# EAGLE design 4x4 (EAGLE 8.4.3)
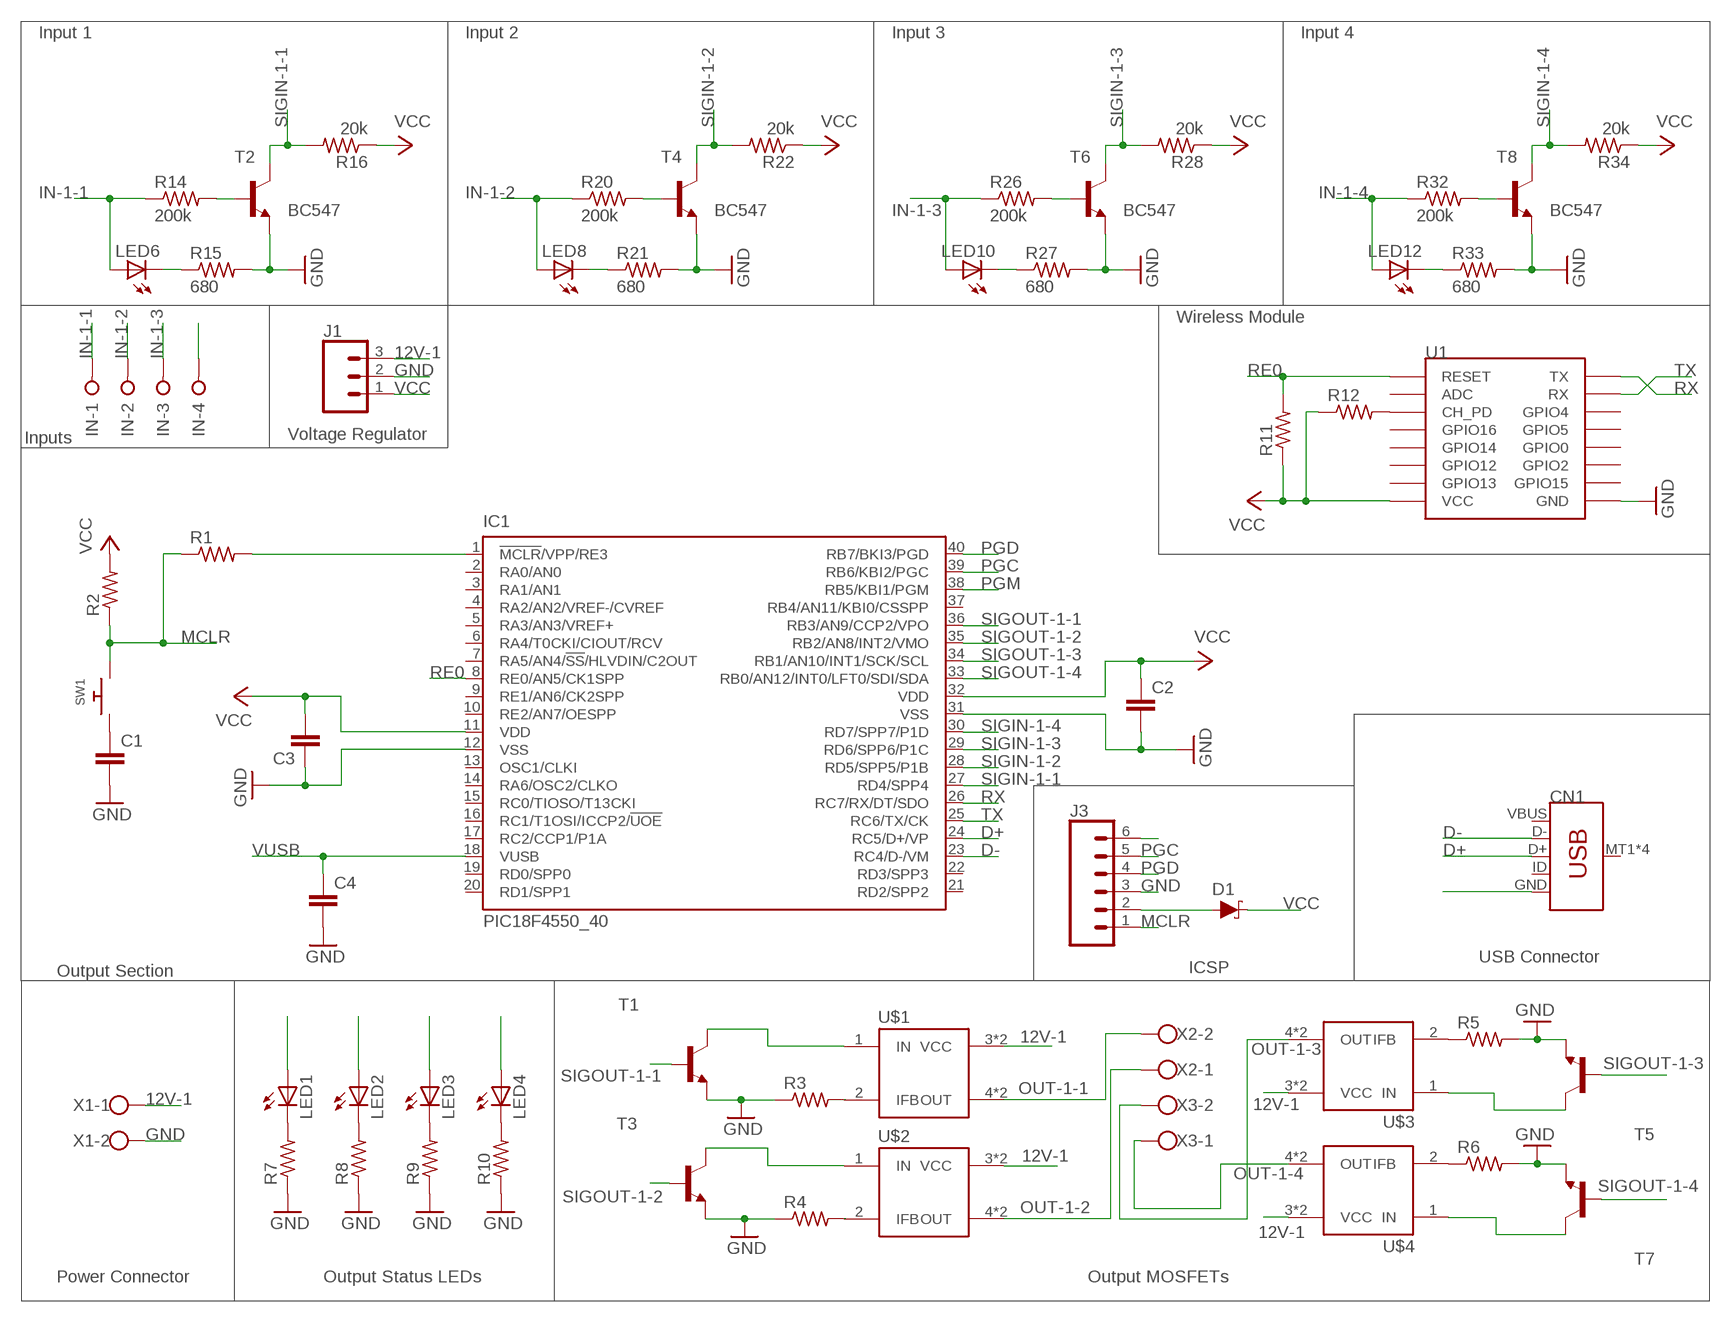
[diagram p0: schematic, sheet 1]

## Parts
C1  C-EUC0805  [C0805]
C2  C-EUC0805  [C0805]
C3  C-EUC0805  [C0805]
C4  C-EUC0805  [C0805]
CN1  USB_MICRO-B_SMT  [USB-MICROB]
D1  DIODE-SCHOTTKY-BAT20J  [SOD-323]
IC1  PIC18F4550_40  [DIL40]
IN  W237-04P  [W237-4P]
J1  CONN_03LONGPADS  [1X03_LONGPADS]
J3  CONN_06LONGPADS  [1X06_LONGPADS]
LED1  LEDCHIP-LED0805  [CHIP-LED0805]
LED2  LEDCHIP-LED0805  [CHIP-LED0805]
LED3  LEDCHIP-LED0805  [CHIP-LED0805]
LED4  LEDCHIP-LED0805  [CHIP-LED0805]
LED6  LEDCHIP-LED0805  [CHIP-LED0805]
LED8  LEDCHIP-LED0805  [CHIP-LED0805]
LED10  LEDCHIP-LED0805  [CHIP-LED0805]
LED12  LEDCHIP-LED0805  [CHIP-LED0805]
R1  R-US_R0805  [R0805]
R2  R-US_R0805  [R0805]
R3  R-US_R0805  [R0805]
R4  R-US_R0805  [R0805]
R5  R-US_R0805  [R0805]
R6  R-US_R0805  [R0805]
R7  R-US_R0805  [R0805]
R8  R-US_R0805  [R0805]
R9  R-US_R0805  [R0805]
R10  R-US_R0805  [R0805]
R11  R-US_R0805  [R0805]
R12  R-US_R0805  [R0805]
R14  200k  R-US_R0805  [R0805]
R15  680  R-US_R0805  [R0805]
R16  20k  R-US_R0805  [R0805]
R20  200k  R-US_R0805  [R0805]
R21  680  R-US_R0805  [R0805]
R22  20k  R-US_R0805  [R0805]
R26  200k  R-US_R0805  [R0805]
R27  680  R-US_R0805  [R0805]
R28  20k  R-US_R0805  [R0805]
R32  200k  R-US_R0805  [R0805]
R33  680  R-US_R0805  [R0805]
R34  20k  R-US_R0805  [R0805]
SW1  SWITCH_PUSHBUTTONSOFTTOUCHSMD_SJ  [PUSHBUTTON_SMD_SJ]
T1  -NPN-SOT23-EBC  [SOT23-EBC]
T2  BC547  BC847ALT1-NPN-SOT23-BEC  [SOT23-BEC]
T3  -NPN-SOT23-EBC  [SOT23-EBC]
T4  BC547  BC847ALT1-NPN-SOT23-BEC  [SOT23-BEC]
T5  -NPN-SOT23-EBC  [SOT23-EBC]
T6  BC547  BC847ALT1-NPN-SOT23-BEC  [SOT23-BEC]
T7  -NPN-SOT23-EBC  [SOT23-EBC]
T8  BC547  BC847ALT1-NPN-SOT23-BEC  [SOT23-BEC]
U1  ESP12SMD  [ESP12-SMD]
U$1  IR3315  [TO-220-5]
U$2  IR3315  [TO-220-5]
U$3  IR3315  [TO-220-5]
U$4  IR3315  [TO-220-5]
X1  W237-102  [W237-102]
X2  W237-102  [W237-102]
X3  W237-102  [W237-102]

## Nets
12V-1: J1.3 U$1.3(VCC) U$1.TAB(VCC) U$2.3(VCC) U$2.TAB(VCC) U$3.3(VCC) U$3.TAB(VCC) U$4.3(VCC) U$4.TAB(VCC) X1.1
D+: CN1.D+ IC1.24(RC5/D+/VP)
D-: CN1.D- IC1.23(RC4/D-/VM)
GND: C1.2 C2.2 C3.1 C4.2 CN1.GND IC1.12(VSS) IC1.31(VSS) J1.2 J3.3 R3.1 R4.1 R5.2 R6.2 R7.1 R8.1 R9.1 R10.1 R15.2 R21.2 R27.2 R33.2 T1.E T2.E T3.E T4.E T5.E T6.E T7.E T8.E U1.GND X1.2
IN-1-1: IN.1 LED6.A R14.1
IN-1-2: IN.2 LED8.A R20.1
IN-1-3: IN.3 LED10.A R26.1
IN-1-4: IN.4 LED12.A R32.1
MCLR: J3.1 R1.1 R2.1 SW1.P$1
N$1: C1.1 SW1.P$2
N$2: R3.2 U$1.2(IFB)
N$3: IC1.1(!MCLR!/VPP/RE3) R1.2
N$4: R5.1 U$3.2(IFB)
N$5: R6.1 U$4.2(IFB)
N$6: LED1.C R7.2
N$7: LED2.C R8.2
N$8: LED3.C R9.2
N$9: LED4.C R10.2
N$10: J3.6
N$11: R12.2 U1.CH_PD
N$12: R14.2 T2.B
N$13: LED6.C R15.1
N$14: R4.2 U$2.2(IFB)
N$16: R20.2 T4.B
N$17: LED8.C R21.1
N$19: D1.A J3.2
N$20: R26.2 T6.B
N$21: LED10.C R27.1
N$24: R32.2 T8.B
N$25: LED12.C R33.1
OUT2: T3.C U$2.1(IN)
OUT3: T5.C U$3.1(IN)
OUT4: T7.C U$4.1(IN)
OUT-1-1: LED1.A U$1.4(OUT) U$1.5(OUT) X2.2
OUT-1-2: LED2.A U$2.4(OUT) U$2.5(OUT) X2.1
OUT-1-3: LED3.A U$3.4(OUT) U$3.5(OUT) X3.2
OUT-1-4: LED4.A U$4.4(OUT) U$4.5(OUT) X3.1
PGC: IC1.39(RB6/KBI2/PGC) J3.5
PGD: IC1.40(RB7/BKI3/PGD) J3.4
PGM: IC1.38(RB5/KBI1/PGM)
RE0: IC1.8(RE0/AN5/CK1SPP) R11.2 U1.RESET
RX: IC1.26(RC7/RX/DT/SDO) U1.TXD0(TX)
SIG1: T1.C U$1.1(IN)
SIGIN-1-1: IC1.27(RD4/SPP4) R16.2 T2.C
SIGIN-1-2: IC1.28(RD5/SPP5/P1B) R22.2 T4.C
SIGIN-1-3: IC1.29(RD6/SPP6/P1C) R28.2 T6.C
SIGIN-1-4: IC1.30(RD7/SPP7/P1D) R34.2 T8.C
SIGOUT-1-1: IC1.36(RB3/AN9/CCP2/VPO) T1.B
SIGOUT-1-2: IC1.35(RB2/AN8/INT2/VMO) T3.B
SIGOUT-1-3: IC1.34(RB1/AN10/INT1/SCK/SCL) T5.B
SIGOUT-1-4: IC1.33(RB0/AN12/INT0/LFT0/SDI/SDA) T7.B
TX: IC1.25(RC6/TX/CK) U1.RXD0(RX)
VCC: C2.1 C3.2 D1.C IC1.11(VDD) IC1.32(VDD) J1.1 R2.2 R11.1 R12.1 R16.1 R22.1 R28.1 R34.1 U1.VCC
VUSB: C4.1 IC1.18(VUSB)
Unconnected: CN1.ID CN1.MT1(SHIELD) CN1.MT2(SHIELD) CN1.P$1(SHIELD) CN1.P$2(SHIELD) IC1.2(RA0/AN0) IC1.3(RA1/AN1) IC1.4(RA2/AN2/VREF-/CVREF) IC1.5(RA3/AN3/VREF+) IC1.6(RA4/T0CKI/CIOUT/RCV) IC1.7(RA5/AN4/!SS!/HLVDIN/C2OUT) IC1.9(RE1/AN6/CK2SPP) IC1.10(RE2/AN7/OESPP) IC1.13(OSC1/CLKI) IC1.14(RA6/OSC2/CLKO) IC1.15(RC0/TIOSO/T13CKI) IC1.16(RC1/T1OSI/ICCP2/!UOE) IC1.17(RC2/CCP1/P1A) IC1.19(RD0/SPP0) IC1.20(RD1/SPP1) IC1.21(RD2/SPP2) IC1.22(RD3/SPP3) IC1.37(RB4/AN11/KBI0/CSSPP) U1.ADC U1.GPIO0 U1.GPIO2 U1.GPIO4 U1.GPIO5 U1.GPIO12 U1.GPIO13 U1.GPIO14 U1.GPIO15 U1.GPIO16

## Notes on the sheet
- Input 1 | Input 2 | Input 3 | Input 4
- Wireless Module
- Inputs | Voltage Regulator
- USB Connector
- Output Section | ICSP
- Power Connector | Output Status LEDs | Output MOSFETs

## Power pins joined to a net without a drawn wire
VBUS: CN1.VBUS

## Library data of the parts
C1-C4 = resistor:C-EU: CAPACITOR, European symbol
CN1 = SparkFun-Connectors:USB_MICRO-B: USB Type Micro-B Connector Male/female and PTH/SMT variants SparkFun Products: SparkFun microB USB Breakout <https://www.sparkfun.com/products/12035> SparkFun USB microB Plug Breakout <https://www.sparkfun.com/products/10031> SparkFun ESP8266 Thing <https://www.sparkfun.com/products/13231>; PROD_ID: CONN-09505; SF_ID: PRT-08533
D1 = SparkFun-DiscreteSemi:DIODE-SCHOTTKY: Schottky diode A Schottky diode is a semiconductor diode which has a low forward voltage drop and a very fast switching action.; PROD_ID: DIO-11623; VALUE: 1A/23V/620mV
IC1 = microchip:PIC18F4*_40: USB Microcontrollers with nanoWatt Technology High-Performance, Enhanced Flash, 28/40/44-Pin, Source: http://ww1.microchip.com/downloads/en/devicedoc/39632c.pdf; MF: MICROCHIP; MPN: PIC18F4550-I/P; OC_FARNELL: 9321357; OC_NEWARK: 74K8623
IN = con-wago-508:W237-04P: WAGO SREW CLAMP; OC_FARNELL: unknown; OC_NEWARK: unknown
J1 = SparkFun-Connectors:CONN_03: Multi connection point. Often used as Generic Header-pin footprint for 0.1 inch spaced/style header connections On any of the 0.1 inch spaced packages, you can populate with these: Break Away Headers - Straight <https://www.sparkfun.com/products/116> (PRT-00116) Break Away Male Headers - Right Angle <https://www.sparkfun.com/products/553> (PRT-00553) Female Headers <https://www.sparkfun.com/products/115> (PRT-00115) Break Away Headers - Machine Pin <https://www.sparkfun.com/products/117> (PRT-00117) Break Away Female Headers - Swiss Machine Pin <https://www.sparkfun.com/products/743> (PRT-00743) Stackable Header - 3 Pin (Female, 0.1") <https://www.sparkfun.com/products/13875> (PRT-13875) For SCREWTERMINALS and SPRING TERMINALS visit here: Screw Terimnals on SparkFun.com <https://www.sparkfun.com/search/results?term=Screw+Terminals> (5mm/3.5mm/2.54mm spacing) This device is also useful as a general connection point to wire up your design to another part of your project. Our various solder wires solder well into these plated through hole pads. Hook-Up Wire - Assortment (Stranded, 22 AWG) <https://www.sparkfun.com/products/11375> (PRT-11375) Hook-Up Wire - Assortment (Solid Core, 22 AWG) <https://www.sparkfun.com/products/11367> (PRT-11367) View the entire wire category on our website here <https://www.sparkfun.com/categories/141> Special notes: Molex polarized connector foot print use with SKU : PRT-08232 with associated crimp pins and housings.
J3 = SparkFun-Connectors:CONN_06: Multi connection point. Often used as Generic Header-pin footprint for 0.1 inch spaced/style header connections On any of the 0.1 inch spaced packages, you can populate with these: Break Away Headers - Straight <https://www.sparkfun.com/products/116> (PRT-00116) Break Away Male Headers - Right Angle <https://www.sparkfun.com/products/553> (PRT-00553) Female Headers <https://www.sparkfun.com/products/115> (PRT-00115) Break Away Headers - Machine Pin <https://www.sparkfun.com/products/117> (PRT-00117) Break Away Female Headers - Swiss Machine Pin <https://www.sparkfun.com/products/743> (PRT-00743) Arduino Stackable Header - 6 Pin <https://www.sparkfun.com/products/9280> (PRT-09280) For SCREWTERMINALS and SPRING TERMINALS visit here: Screw Terimnals on SparkFun.com <https://www.sparkfun.com/search/results?term=Screw+Terminals> (5mm/3.5mm/2.54mm spacing) This device is also useful as a general connection point to wire up your design to another part of your project. Our various solder wires solder well into these plated through hole pads. Hook-Up Wire - Assortment (Stranded, 22 AWG) <https://www.sparkfun.com/products/11375> (PRT-11375) Hook-Up Wire - Assortment (Solid Core, 22 AWG) <https://www.sparkfun.com/products/11367> (PRT-11367) View the entire wire category on our website here <https://www.sparkfun.com/categories/141>
LED1-LED4 = adafruit:LED: LED
LED6 LED8 LED10 LED12 = led:LED: LED
R1-R12 R14-R16 R20-R22 R26-R28 R32-R34 = resistor:R-US_: RESISTOR, American symbol
SW1 = adafruit:SWITCH_PUSHBUTTON: Buttons SOFTTOUCHSMD_SJ - Soft touch temporary push button (Super Junk Akihabara) Compatible with SKPMANE010 [Mouser: 688-SKPMAN] C&K_KSS = Digikey: KSS221GLFS
T1-T8 = transistor:*-NPN-: NPN Transistror BF959 corrected 2008.03.06
U1 = esp8266modules:ESP12: ESP8266 Wifi module 12
U$1-U$4 = jgennari:IR3315
X1-X3 = con-wago-500:W237-102: WAGO SCREW CLAMP; MPN: 237-102; OC_FARNELL: unknown; OC_NEWARK: 70K9898

## Board
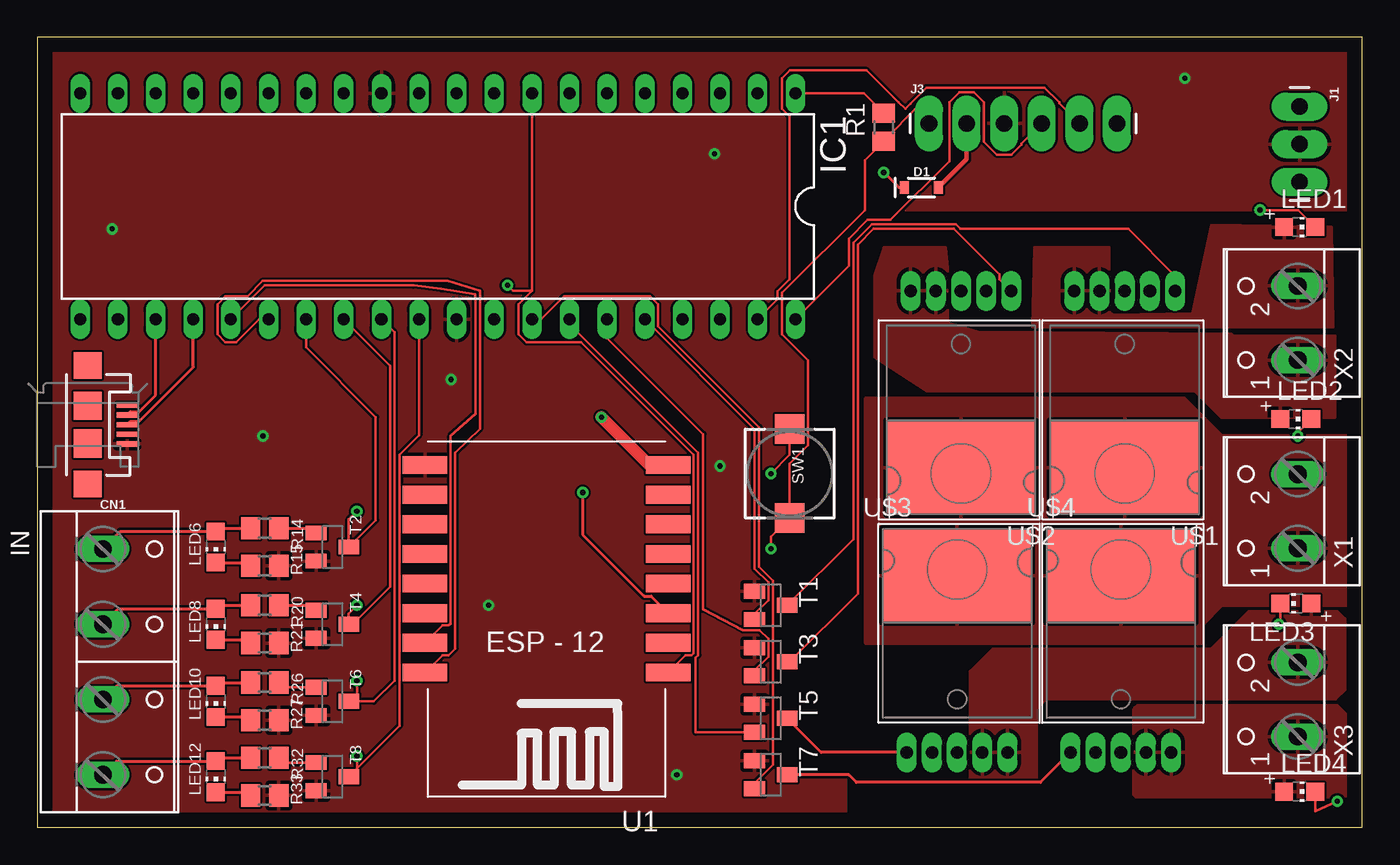
[diagram p1: board, top side]
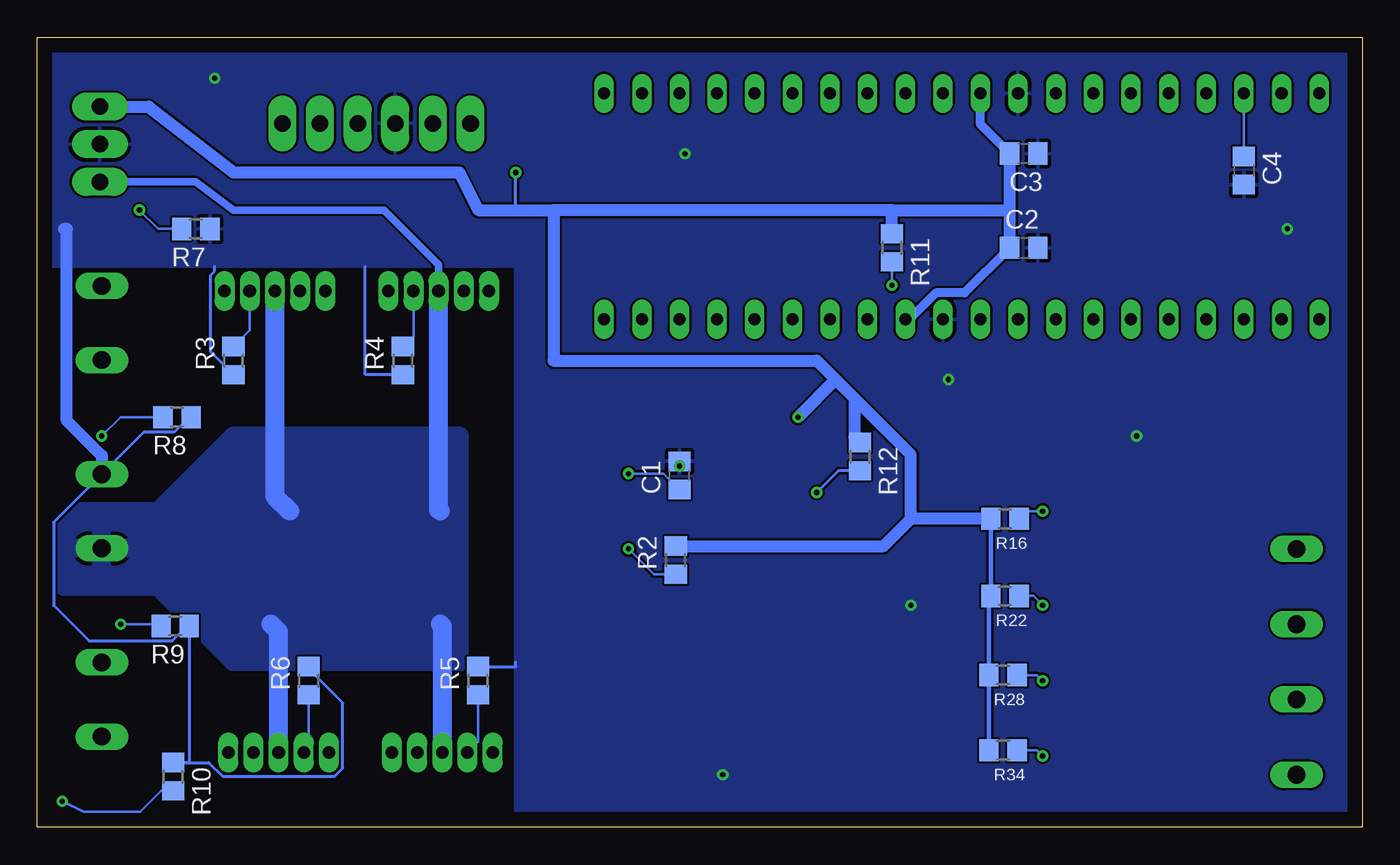
[diagram p2: board, bottom side, seen from below]

Size 89.46 x 53.33 mm. Coordinates in mm from the lower left corner, seen from the top.
Outline: 0,0 89.46,0 89.46,53.33 0,53.33 0,0
Copper layers (1*16): Top 0.035mm / dielectric 1.5mm / Bottom 0.035mm
Design rules "default": minimum track width 6mil, minimum drill 0.35mm, track to track 6mil, track to pad 6mil, pad to pad 6mil, via to via 6mil, smd to smd 6mil, copper to edge 40mil, drill to drill 6mil, minimum pad ring 10mil, minimum via ring 8mil, stop-mask expansion 4mil, vias tented up to drill 0mil, thermal gap 10mil

### Footprints (pad centres in the part's own frame; a part is rotated, then mirrored left to right if it is on the bottom)
C0805 = smd 1.3 x 1.5: 1 -0.95,0; 2 0.95,0
USB-MICROB = smd 1.4 x 0.35: D+ -2.65,0; D- -2.65,-0.65; GND -2.65,1.3; ID -2.65,0.65; VBUS -2.65,-1.3 | smd 1.9 x 1.8: MT1 0,-4; MT2 0,4 | smd 1.9 x 1.9: P$1 0,-1.27; P$2 0,1.27
SOD-323 = smd 0.63 x 0.83: A 1.15,0; C -1.15,0
DIL40 = drill 0.813 long: 1 -24.13,-7.62; 2 -21.59,-7.62; 3 -19.05,-7.62; 4 -16.51,-7.62; 5 -13.97,-7.62; 6 -11.43,-7.62; 7 -8.89,-7.62; 8 -6.35,-7.62; 9 -3.81,-7.62; 10 -1.27,-7.62; 11 1.27,-7.62; 12 3.81,-7.62; 13 6.35,-7.62; 14 8.89,-7.62; 15 11.43,-7.62; 16 13.97,-7.62; 17 16.51,-7.62; 18 19.05,-7.62; 19 21.59,-7.62; 20 24.13,-7.62; 21 24.13,7.62; 22 21.59,7.62; 23 19.05,7.62; 24 16.51,7.62; 25 13.97,7.62; 26 11.43,7.62; 27 8.89,7.62; 28 6.35,7.62; 29 3.81,7.62; 30 1.27,7.62; 31 -1.27,7.62; 32 -3.81,7.62; 33 -6.35,7.62; 34 -8.89,7.62; 35 -11.43,7.62; 36 -13.97,7.62; 37 -16.51,7.62; 38 -19.05,7.62; 39 -21.59,7.62; 40 -24.13,7.62
W237-4P = drill 1.194 long: 1 -7.62,-0.635; 2 -2.54,-0.635; 3 2.54,-0.635; 4 7.62,-0.635
1X03_LONGPADS = drill 1.118 pad 1.88 long: 1 0,0; 2 2.54,0; 3 5.08,0
1X06_LONGPADS = drill 1.118 pad 1.88 long: 1 0,0; 2 2.54,0; 3 5.08,0; 4 7.62,0; 5 10.16,0; 6 12.7,0
CHIP-LED0805 = smd 1.2 x 1.2: A 0,-1.05; C 0,1.05
R0805 = smd 1.3 x 1.5: 1 -0.95,0; 2 0.95,0
PUSHBUTTON_SMD_SJ = smd 2 x 2: P$1 3,0; P$2 -3,0
SOT23-EBC = smd 1 x 1.4: B 0.95,-1.1; C 0,1.1; E -0.95,-1.1
SOT23-BEC = smd 1 x 1.4: B -0.95,-1.1; C 0,1.1; E 0.95,-1.1
ESP12-SMD = smd 3 x 1.2: ADC -8.3,3.8; CH_PD -8.3,1.8; GND 8.1,-8.2; GPIO0 8.1,-2.2; GPIO2 8.1,-4.2; GPIO4 8.1,1.8; GPIO5 8.1,-0.2; GPIO12 -8.3,-4.2; GPIO13 -8.3,-6.2; GPIO14 -8.3,-2.2; GPIO15 8.1,-6.2; GPIO16 -8.3,-0.2; RESET -8.3,5.8; RXD0 8.1,3.8; TXD0 8.1,5.8; VCC -8.3,-8.2
TO-220-5 = drill 0.85 long: 1 -3.4,-12.33; 2 -1.7,-12.33; 3 0,-12.33; 4 1.7,-12.33; 5 3.4,-12.33 | smd 10 x 6.3: TAB 0,-0.4
W237-102 = drill 1.194 long: 1 -2.5,-1.27; 2 2.5,-1.27

### Placement (x,y rotation side)
C1  46.1,23.75 90 bottom
C2  22.86,39.12 0 bottom
C3  22.86,45.47 180 bottom
C4  8,44.32 270 bottom
CN1  3.43,27.18 180 top
D1  59.69,43.18 0 top
IC1  27.05,41.91 180 top
IN  5.08,11.18 270 top
J1  85.22,48.64 270 top
J3  60.2,47.5 0 top
LED1  85.22,40.51 270 top
LED2  84.96,27.56 270 top
LED3  84.96,15.11 90 top
LED4  85.22,2.41 270 top
LED6  12.06,18.92 180 top
LED8  12.06,13.72 180 top
LED10  12.06,8.51 180 top
LED12  12.06,3.43 180 top
R1  57.15,47.24 90 top
R2  46.35,18.03 90 bottom
R3  76.2,31.5 90 bottom
R4  64.77,31.5 90 bottom
R5  59.69,9.91 90 bottom
R6  71.12,9.91 90 bottom
R7  78.74,40.39 180 bottom
R8  80.01,27.69 180 bottom
R9  80.14,13.59 180 bottom
R10  80.26,3.43 270 bottom
R11  31.75,39.12 270 bottom
R12  33.91,25.02 270 bottom
R14  15.37,20.19 0 top
R15  15.37,17.65 0 top
R16  24.13,20.83 0 bottom
R20  15.37,14.99 0 top
R21  15.37,12.45 0 top
R22  24.13,15.62 0 bottom
R26  15.37,9.78 0 top
R27  15.37,7.24 0 top
R28  24.26,10.29 0 bottom
R32  15.37,4.7 0 top
R33  15.37,2.16 0 top
R34  24.26,5.21 0 bottom
SW1  50.8,23.88 270 top
T1  49.53,14.99 270 top
T2  19.94,18.92 270 top
T3  49.53,11.18 270 top
T4  19.94,13.72 270 top
T5  49.53,7.37 270 top
T6  19.94,8.51 270 top
T7  49.53,3.56 270 top
T8  19.94,3.43 270 top
U1  34.29,16.26 180 top
U$1  73.41,23.88 180 top
U$2  62.36,23.88 180 top
U$3  62.1,17.4 0 top
U$4  73.15,17.4 0 top
X1  83.82,21.34 90 top
X2  83.82,34.04 90 top
X3  83.82,8.64 90 top

### Tracks (layer width: path | path; a pad name or v marks a point on that pad's centre or on a via)
12V-1
  Bottom 0.508: 62.36,37.72 U$2.3 62.36,37.97 66.04,41.66 76.2,41.66 78.74,43.56 J1.3
  Bottom 1.27: U$3.3 62.1,13.59 62.23,13.72 | U$4.3 73.15,13.21 73.66,13.72 | U$1.3 73.41,22.35 72.39,21.34 | U$2.3 62.36,21.46 62.23,21.34
  pour Top: 55.88,27.69 55.88,12.45 78.74,12.45 78.74,13.72 80.01,14.99 88.9,14.99 88.9,26.42 81.28,26.42 80.01,26.42 77.47,28.96 55.88,28.96
  pour Bottom: 81.28,16.26 87.63,16.26 88.9,17.53 88.9,20.07 87.63,21.34 81.28,21.34 76.2,26.42 60.96,26.42 60.96,11.18 76.2,11.18
D+
  Top 0.203: CN1.D+ 6.3,27.4 6.88,27.4 10.54,31.06 IC1.24
D-
  Top 0.203: CN1.D- 6.3,28.05 6.88,28.05 8,29.17 IC1.23
GND  (via drill 0.35)
  Bottom 0.203: R8.1 79.2,27.69 80.21,26.68 82.24,26.68 X1.2 88.34,20.58 88.34,14.99 85.94,12.59 80.33,12.59 79.33,13.59 R9.1 79.19,4.38 R10.1 77.86,4.38 76.94,3.46 69.37,3.46 68.82,4 68.82,8.41 71.12,10.71 R6.2 | R4.1 67.31,30.55 67.31,37.85 | 77.47,37.85 77.47,37.54 77.74,37.27 77.74,32.09 R3.1 | R5.2 57.15,10.86 57.15,11.18
  Bottom 0.813: X1.2 85.09,25.09 87.44,27.44 87.44,40.39 87.63,40.39
  other vias: 27.94,30.23 46.1,24.38 5.08,40.39 45.72,45.47 77.47,50.55 43.18,3.56 30.48,14.99 15.24,26.42
  pour Bottom: -2.54,55.63 -2.54,-4.06 57.15,-4.06 57.15,37.85 58.42,37.85 91.44,37.85 91.44,50.55 91.44,55.63
  pour Top: -2.54,55.63 -2.54,-1.52 54.61,-1.52 54.61,41.66 59.69,41.66 90.17,41.66 90.17,53.09 90.17,55.63
IN-1-1
  Top 0.203: IN.1 5.62,19.97 LED6.A 12.29,20.19 R14.1
IN-1-2
  Top 0.203: IN.2 5.5,14.77 LED8.A 12.29,14.99 R20.1
IN-1-3
  Top 0.203: IN.3 5.37,9.56 LED10.A 12.29,9.78 R26.1
IN-1-4
  Top 0.203: IN.4 5.37,4.48 LED12.A 12.29,4.7 R32.1
MCLR  (via drill 0.35)
  Top 0.152: v49.53,18.8 49.53,19.61 SW1.P$1 50.8,24.55 52.03,25.78 52.03,31.52 50.29,33.26 50.29,36.07 55.88,41.66 55.88,45.03 57.37,46.52 | J3.1 59.25,48.45 57.37,46.52 | 57.37,46.52 R1.1
  Bottom 0.152: v49.53,18.8 47.82,17.08 R2.1
N$1  (via drill 0.35)
  Top 0.152: v49.53,23.88 50.8,25.15 SW1.P$2
  Bottom 0.152: C1.1 47.18,23.88 v49.53,23.88
N$2
  Bottom 0.152: U$1.2 75.11,33.54 R3.2
N$3
  Top 0.152: IC1.1 55.81,49.53 R1.2
N$4
  Bottom 0.152: R5.1 59.69,5.78 U$3.2
N$5
  Bottom 0.152: R6.1 71.12,5.4 U$4.2
N$6  (via drill 0.35)
  Top 0.152: v82.55,41.66 85.12,41.66 LED1.C
  Bottom 0.152: R7.2 81.28,40.39 v82.55,41.66
N$7  (via drill 0.35)
  Top 0.152: v85.09,26.42 85.09,26.64 LED2.C
  Bottom 0.152: R8.2 83.82,27.69 v85.09,26.42
N$8  (via drill 0.35)
  Top 0.152: v83.82,13.72 83.91,13.81 LED3.C
  Bottom 0.152: R9.2 81.21,13.72 v83.82,13.72
N$9  (via drill 0.35)
  Top 0.152: v87.76,1.78 86.27,1.11 LED4.C
  Bottom 0.152: R10.2 81.09,2.48 82.49,1.07 86.3,1.07 v87.76,1.78
N$11  (via drill 0.35)
  Top 0.203: U1.CH_PD 41.44,15.6 40.98,15.6 36.83,19.76 v36.83,22.61
  Bottom 0.203: R12.2 35.37,24.07 v36.83,22.61
N$12
  Top 0.203: R14.2 18.52,20.19 T2.B
N$13
  Top 0.203: LED6.C 14.2,17.87 R15.1
N$14
  Bottom 0.152: U$2.2 64.06,33.16 R4.2
N$16
  Top 0.203: R20.2 18.52,14.99 T4.B
N$17
  Top 0.203: LED8.C 14.2,12.67 R21.1
N$19
  Top 0.305: J3.2 62.74,45.08 D1.A
N$20
  Top 0.152: R26.2 16.64,9.46 T6.B
N$21
  Top 0.203: LED10.C 14.2,7.46 R27.1
N$24
  Top 0.152: R32.2 16.64,4.38 T8.B
N$25
  Top 0.203: LED12.C 14.2,2.38 R33.1
OUT2
  Top 0.152: U$2.1 64.97,37 64.97,37.32 61.9,40.39 56.47,40.39 55.4,39.32 55.4,15.77 50.8,11.18 T3.C
OUT3
  Top 0.203: U$3.1 52.93,5.07 T5.C
OUT4
  Top 0.203: T7.C 54.8,3.56 55.3,3.05 67.73,3.05 U$4.1
OUT-1-1
  pour Top: 67.31,39.12 67.18,33.78 87.5,33.78 87.38,40.51 79.25,40.64 77.98,34.67 72.64,34.54 72.39,34.8 72.39,39.12
OUT-1-2
  pour Top: 57.15,39.12 56.52,37.21 56.52,31.75 60.07,29.46 78.11,29.46 79.88,27.69 87.63,27.69 87.63,33.15 80.77,33.15 80.65,33.27 63.5,33.4 61.47,34.04 61.47,37.72 61.34,39.12
OUT-1-3
  pour Top: 62.99,2.16 62.99,10.54 64.52,12.07 79.25,12.07 81.79,14.61 87.76,14.61 88.27,14.1 88.27,9.27 87.63,8.64 82.8,8.64 68.07,8.64 67.95,8.51 67.44,8 67.44,2.03 63.12,2.03
OUT-1-4
  pour Top: 74.04,2.16 74.04,8 74.3,8.26 87.76,8.26 88.39,7.62 88.39,2.03 74.17,2.03
PGC
  Top 0.152: J3.5 68.99,48.87 68.99,48.92 68,49.91 60.02,49.91 58.94,48.84 58.6,48.48 58.13,48.94 55.99,51.08 50.81,51.08 50.29,50.56 50.29,48.5 50.79,48 50.79,37 49.99,36.19 49.99,35.64 IC1.39
PGD
  Top 0.152: IC1.40 54.79,37.9 54.79,39.73 56.06,41 57.6,41 61.57,44.96 61.57,48.92 62.25,49.61 63.22,49.61 63.91,48.92 63.91,46.28 64.79,45.39 65.76,45.39 66.45,46.07 66.45,46.13 J3.4
RE0  (via drill 0.35)
  Top 0.152: U1.RESET 43.76,11.63 44.18,11.63 44.32,11.76 44.32,25.15 36.73,32.74 33.03,32.74 32.51,33.26 32.51,35.32 33.39,36.2 | 33.39,36.2 33.4,36.21 IC1.8 | v31.75,36.58 32.12,36.2 33.39,36.2
  Bottom 0.152: R11.2 v31.75,36.58
RX
  Top 0.152: IC1.26 15,34.29 13.45,32.74 12.71,32.74 12.19,33.26 12.19,35.32 12.71,35.84 14.2,35.84 15.24,36.88 27.7,36.88 29.9,36.21 29.9,26.91 28.22,25.28 28.22,12.07 27.78,11.63 27.36,11.63 U1.TXD0
SIG1
  Top 0.152: U$1.1 76.81,37.24 73.66,40.39 62.33,40.39 62.02,40.69 56.34,40.69 55.09,39.44 55.09,19.45 T1.C
SIGIN-1-1  (via drill 0.35)
  Top 0.152: IC1.27 18.16,32.39 22.86,27.69 22.86,20.74 T2.C 21.04,20.79 v21.59,21.34
  Bottom 0.152: v21.59,21.34 22.67,21.34 R16.2
SIGIN-1-2  (via drill 0.35)
  Top 0.152: IC1.28 23.83,31.17 23.83,16.26 21.29,13.72 T4.C 21.04,14.44 v21.59,14.99
  Bottom 0.152: v21.59,14.99 22.23,15.62 R22.2
SIGIN-1-3  (via drill 0.35)
  Top 0.152: IC1.29 24.13,33.4 24.13,9.91 22.73,8.51 T6.C 21.59,9.06 v21.59,9.91
  Bottom 0.152: v21.59,9.91 21.97,10.29 R28.2
SIGIN-1-4  (via drill 0.35)
  Top 0.152: IC1.30 25.78,26.47 24.46,25.15 24.46,6.85 T8.C 21.59,3.98 v21.59,4.83
  Bottom 0.152: v21.59,4.83 21.97,5.21 R34.2
SIGOUT-1-1
  Top 0.152: IC1.36 48.43,26.88 48.43,17.46 49.36,16.53 49.36,15.34 48.43,14.41 T1.B
SIGOUT-1-2
  Top 0.152: T3.B 48.43,10.6 49.36,11.53 49.36,12.72 48.77,13.31 47.63,13.31 44.96,14.71 44.96,26.54 38.48,33.02 IC1.35
SIGOUT-1-3
  Top 0.152: T5.B 44.45,6.42 44.45,11.46 44.62,11.63 44.62,25.28 35.94,33.96 IC1.34
SIGOUT-1-4
  Top 0.152: T7.B 48.43,2.98 49.66,4.22 49.66,16.66 48.73,17.59 48.73,27.01 41.91,33.83 41.91,35.32 41.39,35.84 35.57,35.84 34.02,34.29 IC1.33
TX
  Top 0.152: U1.RXD0 27.36,13.63 27.78,13.63 27.92,13.76 27.92,26.42 29.59,27.92 29.59,35.57 29.58,35.97 27.28,36.35 25.4,36.58 15.37,36.58 IC1.25
VCC  (via drill 0.35)
  Top 0.203: v57.15,44.2 58.17,43.18 D1.C
  Top 0.813: v38.1,27.69 41.33,24.46 U1.VCC
  Bottom 0.203: 57.15,41.66 v57.15,44.2
  Bottom 0.305: R16.1 R22.1 25.21,15.49 R28.1 R34.1
  Bottom 0.61: C3.2 25.78,47.44 IC1.11 | C2.1 26.86,36.07 28.78,36.07 30.56,34.29 IC1.32
  Bottom 0.813: J1.1 81.92,48.64 76.2,44.2 60.96,44.2 59.69,41.66 57.15,41.66 54.61,41.66 | 54.61,41.66 54.61,31.5 36.83,31.5 35.56,30.23 | 35.56,30.23 34.29,28.96 | 34.29,28.96 34.29,26.35 R12.1 | 31.75,41.66 54.61,41.66 | 31.75,41.66 23.81,41.66 | R11.1 31.75,41.66 | 35.56,30.23 v38.1,27.69 | 34.29,28.96 30.48,25.15 30.48,20.83 | R2.2 32.32,18.98 30.48,20.83 | R16.1 30.48,20.83 | C2.1 23.81,41.66 | 23.81,41.66 C3.2
VUSB
  Bottom 0.152: IC1.18 C4.1